# Altium project mbed-enablement-platform_F.PrjPcb
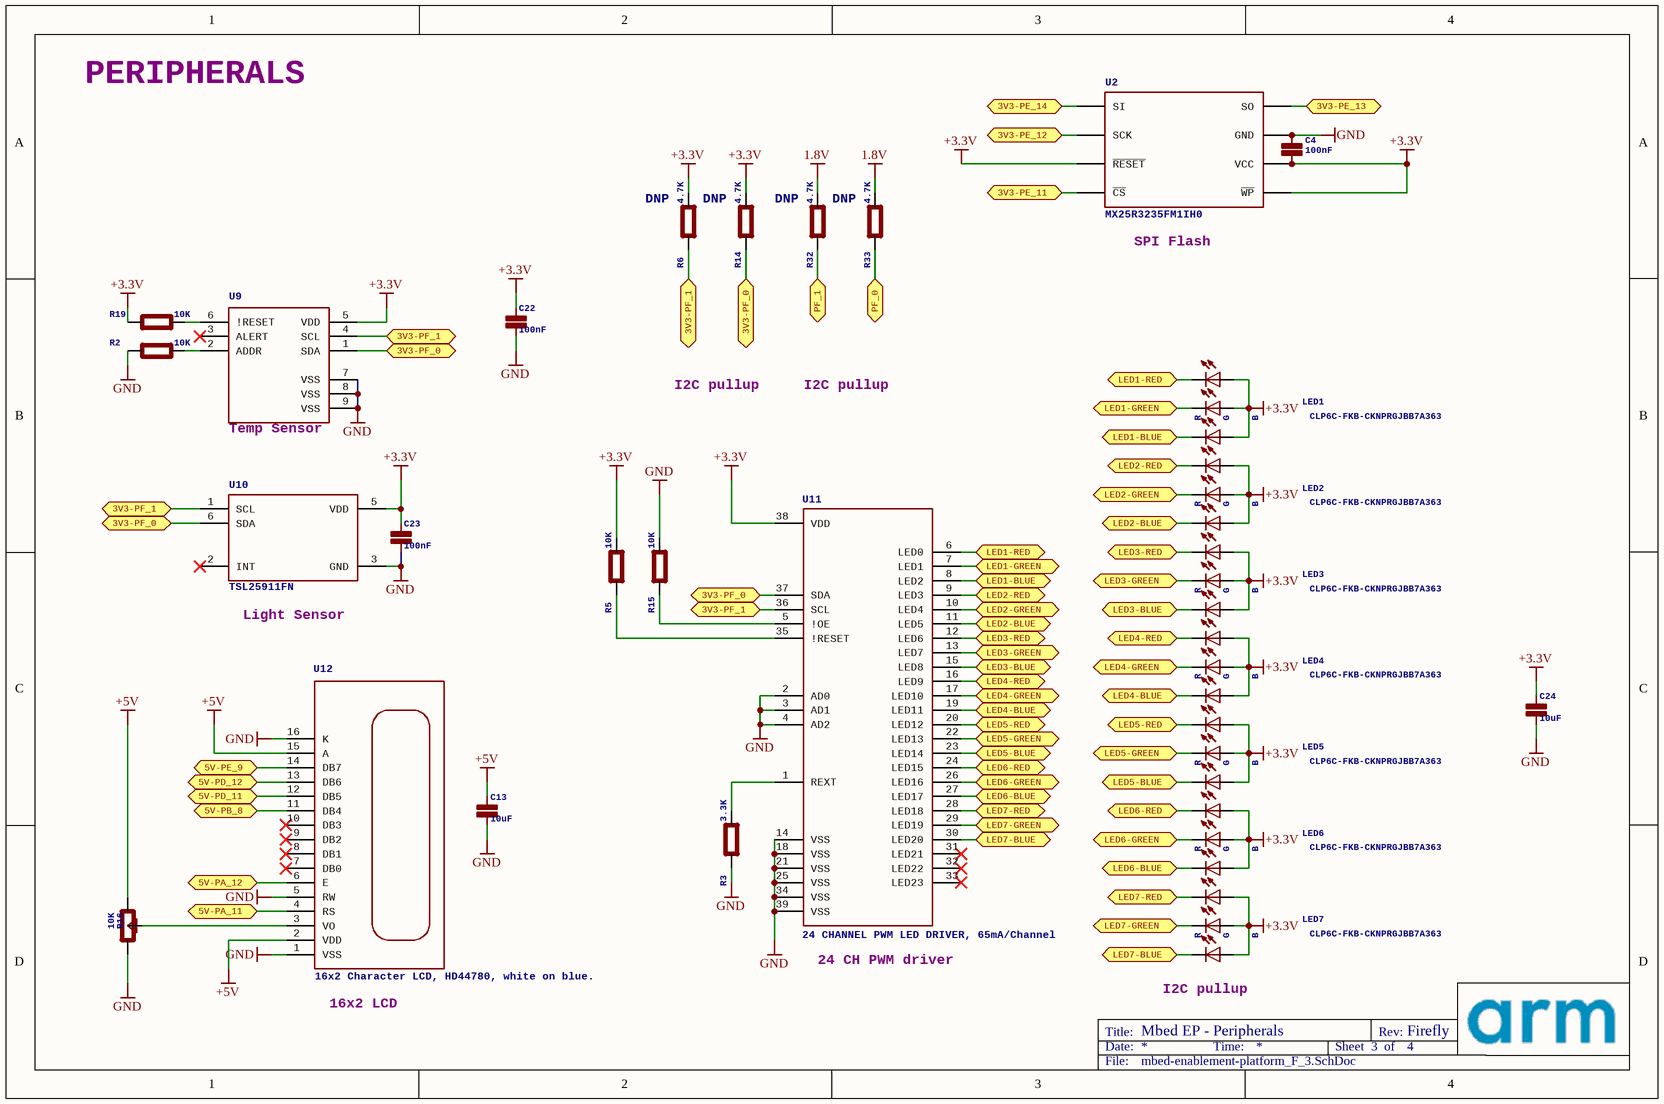
[diagram p0: mbed-enablement-platform_F_3.SchDoc]
2 sheets, 74 parts. Net scope: flat (ports and power ports of the same name join across sheets).
Board file: mbed-enablement-platform_F.PcbDoc
Sheets:
  mbed-enablement-platform_F_3.SchDoc
  mbed-enablement-platform_F_4.SchDoc

## Sheet mbed-enablement-platform_F_3.SchDoc: Mbed EP - Peripherals
size A4; Date: 10/26/2017 12:01:22 PM; Revision: Firefly; SheetNumber: 3; SheetTotal: 4

### Parts
C4  100nF  [0603]
C13  10uF  [0603]
C22  100nF  [0402]
C23  100nF  [0402]
C24  10uF  [0603]
LED1  CLP6C-FKB-CKNPRGJBB7A363  [6-PLCC]
LED2  CLP6C-FKB-CKNPRGJBB7A363  [6-PLCC]
LED3  CLP6C-FKB-CKNPRGJBB7A363  [6-PLCC]
LED4  CLP6C-FKB-CKNPRGJBB7A363  [6-PLCC]
LED5  CLP6C-FKB-CKNPRGJBB7A363  [6-PLCC]
LED6  CLP6C-FKB-CKNPRGJBB7A363  [6-PLCC]
LED7  CLP6C-FKB-CKNPRGJBB7A363  [6-PLCC]
R2  10K  [0402]
R3  3.3K  [0402]
R5  10K  [0402]
R6  4.7K  [0402]
R14  4.7K  [0402]
R15  10K  [0402]
R16  10K  [TC33X-2-103E]
R19  10K  [0402]
R32  4.7K  [0402]
R33  4.7K  [0402]
U2  MX25R3235FM1IH0  [SO8]
U9  Temperature and Humidity Sensor I2C 2% 8DFN  [8-DFN]  (value not drawn)
U10  TSL25911FN  [6-WFDFN]
U11  24 CHANNEL PWM LED DRIVER, 65mA/Channel  [HTSSOP38]
U12  16x2 Character LCD, HD44780, white on blue.  [LCD1602]

### Ports
3V3-PE_11, 3V3-PE_12, 3V3-PE_13, 3V3-PE_14, 3V3-PF_0, 3V3-PF_1, 5V-PA_11, 5V-PA_12, 5V-PB_8, 5V-PD_11, 5V-PD_12, 5V-PE_9, LED1-BLUE, LED1-GREEN, LED1-RED, LED2-BLUE, LED2-GREEN, LED2-RED, LED3-BLUE, LED3-GREEN, LED3-RED, LED4-BLUE, LED4-GREEN, LED4-RED, LED5-BLUE, LED5-GREEN, LED5-RED, LED6-BLUE, LED6-GREEN, LED6-RED, LED7-BLUE, LED7-GREEN, LED7-RED, PF_0, PF_1

### Nets
1.8V: R32.2(P$2) R33.2(P$2)
+3.3V: C4.2(P$2) C22.1(P$1) C23.1(P$1) C24.1(P$1) LED1.1 LED1.2 LED1.3 LED2.1 LED2.2 LED2.3 LED3.1 LED3.2 LED3.3 LED4.1 LED4.2 LED4.3 LED5.1 LED5.2 LED5.3 LED6.1 LED6.2 LED6.3 LED7.1 LED7.2 LED7.3 R5.2(P$2) R6.2(P$2) R14.2(P$2) R19.1(P$1) U2.3(~{WP}) U2.7(~{RESET}) U2.8(VCC) U9.5(VDD) U10.5(VDD) U11.38(VDD)
+5V: C13.1(P$1) R16.1(P$1) U12.2(VDD) U12.15(A)
GND: C4.1(P$1) C13.2(P$2) C22.2(P$2) C23.2(P$2) C24.2(P$2) R2.1(P$1) R3.1(P$1) R15.2(P$2) R16.3(P$3) U2.4(GND) U9.7(VSS) U9.8(VSS) U9.9(VSS) U10.3(GND) U11.2(AD0) U11.3(AD1) U11.4(AD2) U11.14(VSS) U11.18(VSS) U11.21(VSS) U11.25(VSS) U11.34(VSS) U11.39(VSS) U12.1(VSS) U12.5(RW) U12.16(K)
3V3-PE_11: U2.1(~{CS}) ; port 3V3-PE_11
3V3-PE_12: U2.6(SCK) ; port 3V3-PE_12
3V3-PE_13: U2.2(SO) ; port 3V3-PE_13
3V3-PE_14: U2.5(SI) ; port 3V3-PE_14
3V3-PF_0: R14.1(P$1) U9.1(SDA) U10.6(SDA) U11.37(SDA) ; port 3V3-PF_0
3V3-PF_1: R6.1(P$1) U9.4(SCL) U10.1(SCL) U11.36(SCL) ; port 3V3-PF_1
5V-PA_11: U12.4(RS) ; port 5V-PA_11
5V-PA_12: U12.6(E) ; port 5V-PA_12
5V-PB_8: U12.11(DB4) ; port 5V-PB_8
5V-PD_11: U12.12(DB5) ; port 5V-PD_11
5V-PD_12: U12.13(DB6) ; port 5V-PD_12
5V-PE_9: U12.14(DB7) ; port 5V-PE_9
LED1-BLUE: LED1.4 U11.8(LED2) ; port LED1-BLUE
LED1-GREEN: LED1.5 U11.7(LED1) ; port LED1-GREEN
LED1-RED: LED1.6 U11.6(LED0) ; port LED1-RED
LED2-BLUE: LED2.4 U11.11(LED5) ; port LED2-BLUE
LED2-GREEN: LED2.5 U11.10(LED4) ; port LED2-GREEN
LED2-RED: LED2.6 U11.9(LED3) ; port LED2-RED
LED3-BLUE: LED3.4 U11.15(LED8) ; port LED3-BLUE
LED3-GREEN: LED3.5 U11.13(LED7) ; port LED3-GREEN
LED3-RED: LED3.6 U11.12(LED6) ; port LED3-RED
LED4-BLUE: LED4.4 U11.19(LED11) ; port LED4-BLUE
LED4-GREEN: LED4.5 U11.17(LED10) ; port LED4-GREEN
LED4-RED: LED4.6 U11.16(LED9) ; port LED4-RED
LED5-BLUE: LED5.4 U11.23(LED14) ; port LED5-BLUE
LED5-GREEN: LED5.5 U11.22(LED13) ; port LED5-GREEN
LED5-RED: LED5.6 U11.20(LED12) ; port LED5-RED
LED6-BLUE: LED6.4 U11.27(LED17) ; port LED6-BLUE
LED6-GREEN: LED6.5 U11.26(LED16) ; port LED6-GREEN
LED6-RED: LED6.6 U11.24(LED15) ; port LED6-RED
LED7-BLUE: LED7.4 U11.30(LED20) ; port LED7-BLUE
LED7-GREEN: LED7.5 U11.29(LED19) ; port LED7-GREEN
LED7-RED: LED7.6 U11.28(LED18) ; port LED7-RED
PF_0: R33.1(P$1) ; port PF_0
PF_1: R32.1(P$1) ; port PF_1
NetR2_2: R2.2(P$2) U9.2(ADDR)
NetR3_2: R3.2(P$2) U11.1(REXT)
NetR5_1: R5.1(P$1) U11.35(!RESET)
NetR15_1: R15.1(P$1) U11.5(!OE)
NetR16_2: R16.2(P$2) U12.3(VO)
NetR19_2: R19.2(P$2) U9.6(!RESET)

Not connected (* = marked no-connect by the designer): U9 3(ALERT)*; U10 2(INT)*; U11 31(LED21)* 32(LED22)* 33(LED23)*; U12 7(DB0)* 8(DB1)* 9(DB2)* 10(DB3)*

### Notes on the sheet
- PERIPHERALS
- (near R6) DNP
- DNP
- (near U2) SPI Flash
- I2C pullup
- (near U9) Temp Sensor
- (near U10) Light Sensor
- (near U11) 24 CH PWM driver
- (near U12) 16x2 LCD
- (near LED7) I2C pullup
- Title:
- Date:
- Time:
- Sheet
- Rev:
- of
- File:

### Library data of the parts
C4 C13 C24 = CAPACITOR0603: Capacitor
C22 C23 = CAPACITOR0402: Capacitor
LED1-LED7 = CLP6C-FKB-CKNPRGJBB7A363: LED RGB SMD Diffused; MF: Cree Inc.; MFN: CLP6C-FKB-CKNPRGJBB7A363; OC-DIGIKEY: CLP6C-FKB-CKNPRGJBB7A363CT-ND; OC-MOUSER: 941-P6CFKBCKNPRGJ7A3; OC-NEWARK: 11X6459; B: B; R: R; G: G
R2 R3 R5 R6 R14 R15 R19 R32 R33 = RESISTOR0402: Resistor
R16 = POTENTIOMETER: TRIMMER 10K OHM 0.1W SMD; MF: Bourns Inc.; MFN: TC33X-2-103E; OC-DIGIKEY: TC33X-103ECT-ND; OC-MOUSER: 652-TC33X-2-103E; OC-NEWARK: 97M3836
U2 = MX25R3235FM1IH0: Serial Flash 32 Mb 80 Mhz; MF: Macronix; MFN: MX25R3235FM1IH0; OC-DIGIKEY: 1092-1175-ND; OC-MOUSER: *; OC-NEWARK: *
U9 = SHT31-DIS-B: MF: Sensirion; MFN: SHT31-DIS-B; OC-DIGIKEY: 1649-1011-1-ND; OC-MOUSER: 403-SHT31-DIS-B; OC-NEWARK: 2474218
U10 = TSL25911FN: Sensor Light Digital, High Dynamic Range, 6-WFDFN; MF: ams; MFN: TSL25911FN; OC-DIGIKEY: TSL25911FNCT-ND; OC-MOUSER: 985-TSL25911FN; OC-NEWARK: 09X0688
U11 = PCA9956BTWY: MF: NXP USA Inc.; MFN: PCA9956BTWY; OC-DIGIKEY: 568-12502-1-ND; OC-MOUSER: 771-PCA9956BTWY; OC-NEWARK: 2759860
U12 = 1528-1502-ND: MF: Adafruit Industries LLC; MFN: 181; OC-DIGIKEY: 1528-1502-ND; OC-NEWARK: 53W5770

## Sheet mbed-enablement-platform_F_4.SchDoc: Mbed EP - Power
size A4; Date: 10/26/2017 12:01:24 PM; Revision: Firefly; SheetNumber: 4; SheetTotal: 4
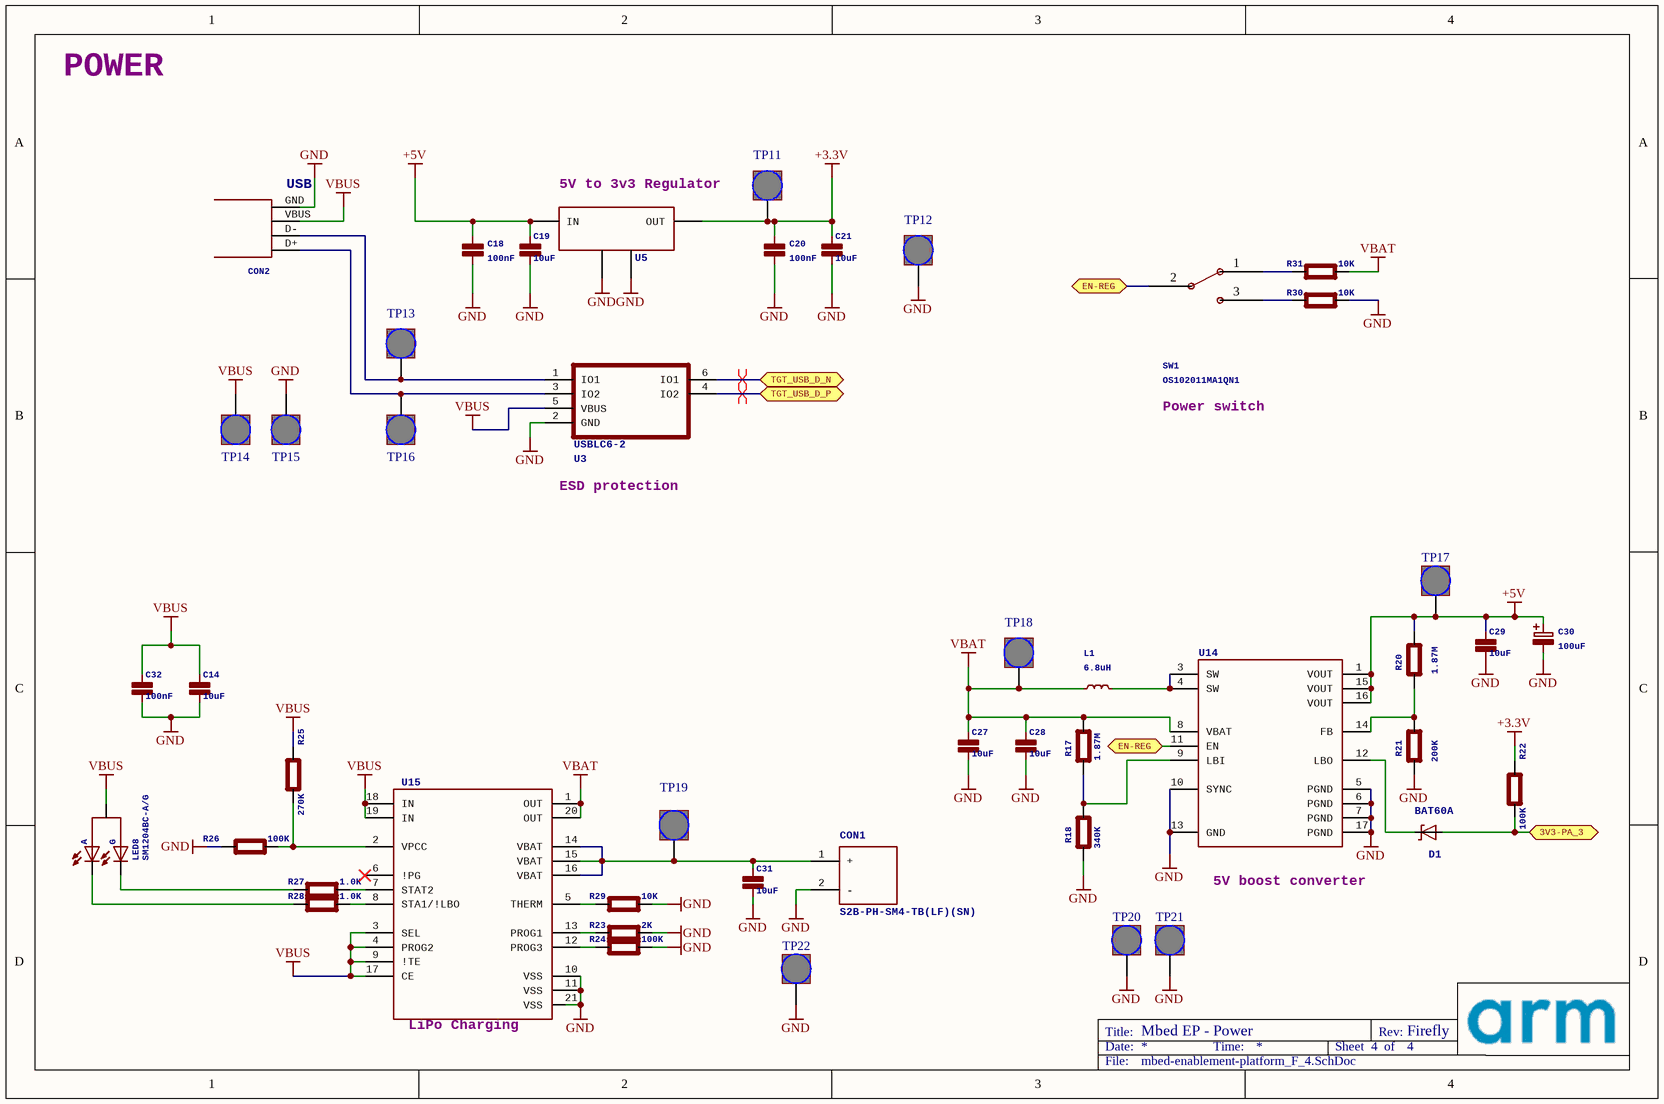
[diagram p1: mbed-enablement-platform_F_4.SchDoc]

### Parts
C14  10uF  [0603]
C18  100nF  [0402]
C19  10uF  [0603]
C20  100nF  [0402]
C21  10uF  [0603]
C27  10uF  [0603]
C28  10uF  [0603]
C29  10uF  [0603]
C30  100uF  [SMC_B]
C31  10uF  [0603]
C32  100nF  [0603]
CON1  S2B-PH-SM4-TB(LF)(SN)  [S2B-PH-SM4-TB(LF)(SN)]
CON2  47346-0001  [USB-MICRO-B-H]  (value not drawn)
D1  BAT60A  [SOD323]
L1  6.8uH  [NR8040T6R8N]
LED8  SM1204BC-A/G  [CHIPLED_1204]
R17  1.87M  [0402]
R18  340K  [0402]
R20  1.87M  [0402]
R21  200K  [0402]
R22  100K  [0402]
R23  2K  [0402]
R24  100K  [0402]
R25  270K  [0402]
R26  100K  [0402]
R27  1.0K  [0402]
R28  1.0K  [0402]
R29  10K  [0402]
R30  10K  [0402]
R31  10K  [0402]
SW1  OS102011MA1QN1  [OS102011MA1QN1]
TP11  TP, 1.5mm  [TP1.5]  (value not drawn)
TP12  TP, 1.5mm  [TP1.5]  (value not drawn)
TP13  TP, 1.5mm  [TP1.5]  (value not drawn)
TP14  TP, 1.5mm  [TP1.5]  (value not drawn)
TP15  TP, 1.5mm  [TP1.5]  (value not drawn)
TP16  TP, 1.5mm  [TP1.5]  (value not drawn)
TP17  TP, 1.5mm  [TP1.5]  (value not drawn)
TP18  TP, 1.5mm  [TP1.5]  (value not drawn)
TP19  TP, 1.5mm  [TP1.5]  (value not drawn)
TP20  TP, 1.5mm  [TP1.5]  (value not drawn)
TP21  TP, 1.5mm  [TP1.5]  (value not drawn)
TP22  TP, 1.5mm  [TP1.5]  (value not drawn)
U3  USBLC6-2SC6SC6  [SOT23-6L]  (value not drawn)
U5  LDO Fixed Regulator 3.3v, 1.5A  [SOT223]  (value not drawn)
U14  Boost Converter 2A Switch, 96% Efficient Boost  [QFN-16]  (value not drawn)
U15  Lithium-Ion/Polymer Charger IC 4.2V (1000mA)  [QFN-20]  (value not drawn)

### Ports
3V3-PA_3, EN-REG, TGT_USB_D_N (bidir), TGT_USB_D_P (bidir)

### Nets
+3.3V: C20.1(P$1) C21.1(P$1) R22.1(P$1) TP11.1 U5.3(OUT)
+5V: C18.1(P$1) C19.1(P$1) C29.1(P$1) C30.+ R20.1(P$1) TP17.1 U5.1(IN) U14.1(VOUT) U14.15(VOUT) U14.16(VOUT)
GND: C14.2(P$2) C18.2(P$2) C19.2(P$2) C20.2(P$2) C21.2(P$2) C27.2(P$2) C28.2(P$2) C29.2(P$2) C30.- C31.2(P$2) C32.2(P$2) CON1.2(-) CON2.GND R18.2(P$2) R21.2(P$2) R23.2(P$2) R24.2(P$2) R26.1(P$1) R29.2(P$2) R30.2(P$2) TP12.1 TP15.1 TP20.1 TP21.1 TP22.1 U3.2(GND) U5.2(GND) U5.4(GND) U14.5(PGND) U14.6(PGND) U14.7(PGND) U14.10(SYNC) U14.13(GND) U14.17(PGND) U15.10(VSS) U15.11(VSS) U15.21(VSS)
VBAT: C27.1(P$1) C28.1(P$1) L1.P$1 R17.1(P$1) R31.2(P$2) TP18.1 U14.8(VBAT) U15.1(OUT) U15.20(OUT)
VBUS: C14.1(P$1) C32.1(P$1) CON2.VBUS LED8.P$1 R25.1(P$1) TP14.1 U3.5(VBUS) U15.3(SEL) U15.4(PROG2) U15.9(!TE) U15.17(CE) U15.18(IN) U15.19(IN)
3V3-PA_3: D1.A R22.2(P$2) ; port 3V3-PA_3
EN-REG: SW1.2 U14.11(EN) ; port EN-REG
TGT_USB_D_N: U3.6(IO1) ; port TGT_USB_D_N
TGT_USB_D_P: U3.4(IO2) ; port TGT_USB_D_P
NetC31_1: C31.1(P$1) CON1.1(+) TP19.1 U15.14(VBAT) U15.15(VBAT) U15.16(VBAT)
NetCON2_D+: CON2.D+ TP16.1 U3.3(IO2)
NetCON2_D-: CON2.D- TP13.1 U3.1(IO1)
NetD1_K: D1.K U14.12(LBO)
NetL1_P$2: L1.P$2 U14.3(SW) U14.4(SW)
NetLED8_P$2: LED8.P$2 R28.1(P$1)
NetLED8_P$3: LED8.P$3 R27.1(P$1)
NetR17_2: R17.2(P$2) R18.1(P$1) U14.9(LBI)
NetR20_2: R20.2(P$2) R21.1(P$1) U14.14(FB)
NetR23_1: R23.1(P$1) U15.13(PROG1)
NetR24_1: R24.1(P$1) U15.12(PROG3)
NetR25_2: R25.2(P$2) R26.2(P$2) U15.2(VPCC)
NetR27_2: R27.2(P$2) U15.7(STAT2)
NetR28_2: R28.2(P$2) U15.8(STA1/!LBO)
NetR29_1: R29.1(P$1) U15.5(THERM)
NetR30_1: R30.1(P$1) SW1.3
NetR31_1: R31.1(P$1) SW1.1

Not connected (* = marked no-connect by the designer): U15 6(!PG)*

### Layout directives
differential pair: TGT_USB_D_N, TGT_USB_D_P

### Notes on the sheet
- POWER
- (near U5) 5V to 3v3 Regulator
- Power switch
- (near U3) ESD protection
- (near U14) 5V boost converter
- (near U15) LiPo Charging
- Title:
- Date:
- Time:
- Sheet
- Rev:
- of
- File:

### Library data of the parts
C14 C19 C21 C27-C29 C31 C32 = CAPACITOR0603: Capacitor
C18 C20 = CAPACITOR0402: Capacitor
C30 = CAPACITOR-POLARISEDB: Polarised capacitor; MF: Kemet; MFN: T491B106K020AT; OC-DIGIKEY: 399-8298-1-ND; OC-MOUSER: 80-T491B106K020; OC-NEWARK: 57K1740
CON1 = S2B-PH-SM4-TB(LF)(SN): 2 Position 2 mm JST PH Series Pitch Surface Mount Side Entry Shrouded Header; MF: JST; MFN: S2B-PH-SM4-TB(LF)(SN); OC-DIGIKEY: 455-1749-1-ND; OC-MOUSER: *; OC-NEWARK: 38K8067
CON2 = 47346-0001: USB Receptacle Horizontal Micro Type B; MF: MOLEX; MFN: 47346-0001; OC-DIGIKEY: WM17141CT-ND; OC-MOUSER: 538-47346-0001; OC-NEWARK: 1568026; USB: USB
D1 = BAT60A: SCHOTTKY DIODE; MF: Infineon; MFN: BAT60AE6327HTSA1; OC-DIGIKEY: BAT60AE6327HTSA1CT-ND; OC-MOUSER: 726-BAT60AE6327; OC-NEWARK: 85X4127
L1 = INDUCTORNR8040T6R8N: Inductor; MF: Taiyo Yuden; MFN: NR8040T6R8N; OC-DIGIKEY: 587-2000-1-ND; OC-MOUSER: 963-NR8040T6R8N; OC-NEWARK: *
LED8 = SM1204BC-A/G: Dual Colour LED SMD Right Angle, Colour Amber/Green; MF: Bivar; MFN: SM1204BC-A/G; OC-DIGIKEY: 492-1229-2-ND; OC-MOUSER: 749-SM1204BC-A/G; OC-NEWARK: 1814269; G: G; A: A
R17 R18 R20-R31 = RESISTOR0402: Resistor
SW1 = OS102011MA1QN1: SWITCH SLIDE SPDT 100MA 12V; MF: C&K Components; MFN: OS102011MA1QN1
TP11-TP22 = TP1.5: 1.5mm round test point
U3 = USBLC6-2SC6SC6: ESD USB Protection Bi-Directional; MF: STMicroelectronics; MFN: USBLC6-2SC6; OC-DIGIKEY: 497-5235-1-ND; OC-MOUSER: 511-USBLC6-2SC6; OC-NEWARK: 26M4748; USBLC6-2: USBLC6-2
U5 = TL1963A-33DCYR: MF: Texas Instruments; MFN: TL1963A-33DCYR; OC-DIGIKEY: 296-24897-1-ND; OC-MOUSER: 595-TL1963A-33DCYR; OC-NEWARK: 94T5083
U14 = TPS61090RSAR: MF: Texas Instruments; MFN: TPS61090RSAR; OC-DIGIKEY: 296-15259-1-ND; OC-MOUSER: 595-TPS61090RSAR; OC-NEWARK: 73H4652
U15 = MCP73871-2CCI/ML: MF: Microchip; MFN: MCP73871-2CCI/ML; OC-DIGIKEY: MCP73871-2CCI/ML-ND; OC-MOUSER: 579-MCP73871-2CCI/ML; OC-NEWARK: 1642489

## Nets that join several sheets
+3.3V: mbed-enablement-platform_F_3 (35 pins), mbed-enablement-platform_F_4 (5 pins)
+5V: mbed-enablement-platform_F_3 (C13.1 R16.1 U12.2 U12.15), mbed-enablement-platform_F_4 (10 pins)
GND: mbed-enablement-platform_F_3 (26 pins), mbed-enablement-platform_F_4 (37 pins)